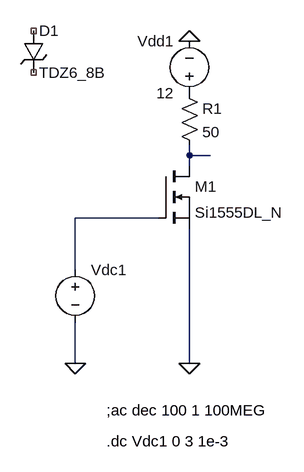
[diagram p0: schematic Draft2.asc]
Draft2.asc, the LTspice schematic file:
Version 4
SHEET 1 880 680
WIRE 208 -160 208 -176
WIRE 240 -160 208 -160
WIRE 208 -144 208 -160
WIRE 160 -64 32 -64
WIRE 32 16 32 -64
WIRE 32 160 32 96
WIRE 208 160 208 -48
FLAG 32 160 0
FLAG 208 160 0
FLAG 208 -336 0
SYMBOL voltage 32 0 R0
WINDOW 123 0 0 Left 2
WINDOW 39 0 0 Left 2
SYMATTR InstName Vdc1
SYMATTR Value ""
SYMBOL res 192 -272 R0
SYMATTR InstName R1
SYMATTR Value 50
SYMBOL nmos 160 -144 R0
SYMATTR InstName M1
SYMATTR Value Si1555DL_N
SYMBOL voltage 208 -240 R180
WINDOW 0 24 96 Left 2
WINDOW 3 24 16 Left 2
WINDOW 123 0 0 Left 2
WINDOW 39 0 0 Left 2
SYMATTR InstName Vdd1
SYMATTR Value 12
SYMBOL zener -48 -352 R0
SYMATTR InstName D1
SYMATTR Value TDZ6_8B
SYMATTR Description Diode
SYMATTR Type diode
TEXT 80 232 Left 2 !;ac dec 100 1 100MEG
TEXT 80 280 Left 2 !.dc Vdc1 0 3 1e-3

The netlist it stands for:
* Draft2.asc
Vdc1 N002 0
R1 P001 N001 50
M1 N001 N002 0 0 Si1555DL_N
Vdd1 P001 0 12
D1 NC_01 NC_02 TDZ6_8B
.model D D
.lib standard.dio
.model NMOS NMOS
.model PMOS PMOS
.lib standard.mos
;ac dec 100 1 100MEG
.dc Vdc1 0 3 1e-3
.backanno
.end